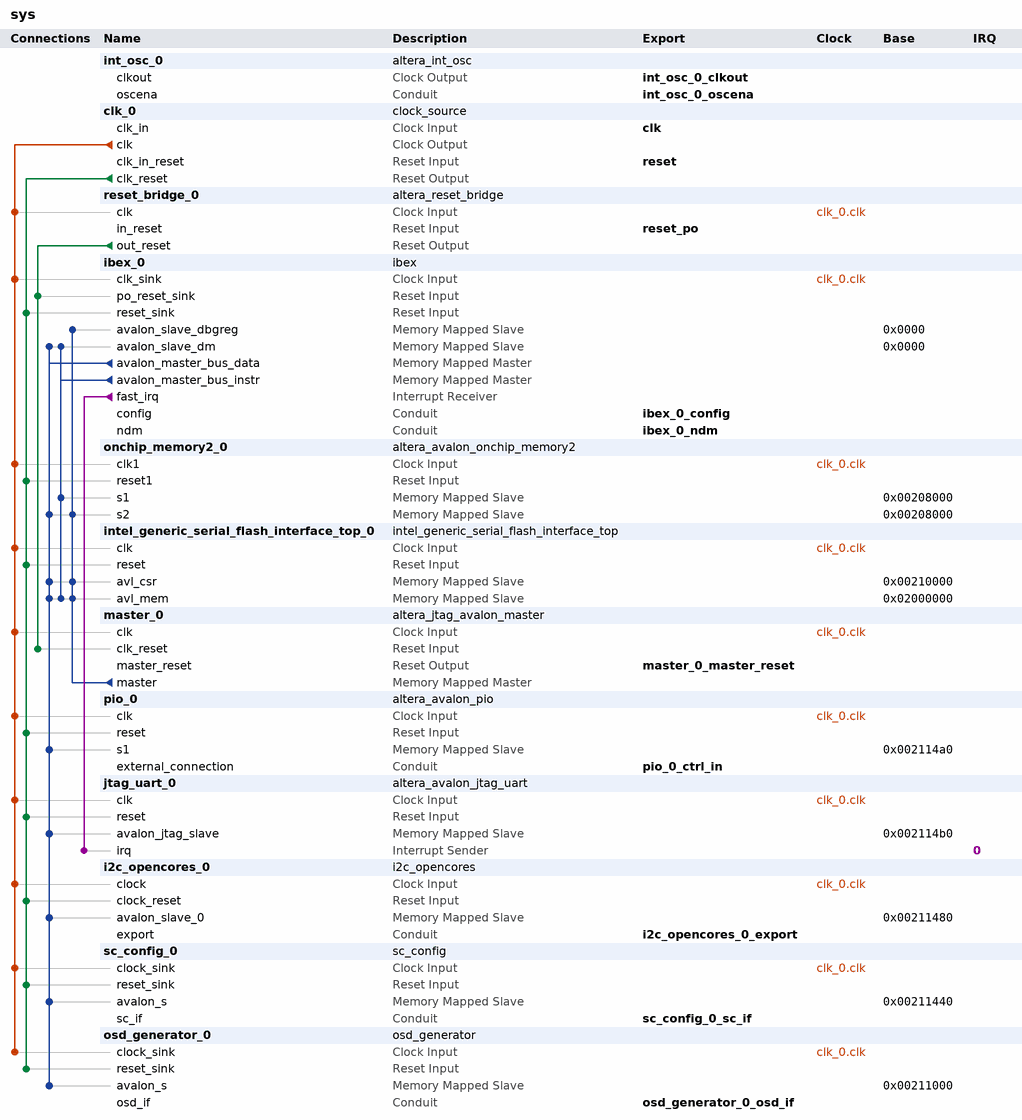
[diagram p0: system contents]
# Platform Designer (Qsys) system sys, Cyclone 10 LP 10CL025YE144C8G
# Parameters at their usual value, and those the tool derives, are not listed.
package require -exact qsys 24.1
create_system sys
set_project_property DEVICE_FAMILY {Cyclone 10 LP}
set_project_property DEVICE 10CL025YE144C8G

add_instance int_osc_0 altera_int_osc 24.1
set_instance_parameter_value int_osc_0 CBX_AUTO_BLACKBOX ALL
set_instance_parameter_value int_osc_0 CLOCK_FREQUENCY_1 116
set_instance_parameter_value int_osc_0 CLOCK_FREQUENCY_2 77
set_instance_parameter_value int_osc_0 PART_NAME 10CL025YE144C8G

add_instance clk_0 clock_source 24.1
set_instance_parameter_value clk_0 clockFrequency 40000000

add_instance reset_bridge_0 altera_reset_bridge 24.1
set_instance_parameter_value reset_bridge_0 ACTIVE_LOW_RESET 1
set_instance_parameter_value reset_bridge_0 SYNCHRONOUS_EDGES deassert

add_instance ibex_0 ibex 1.0
set_instance_parameter_value ibex_0 IBEX_ICACHE true
set_instance_parameter_value ibex_0 IBEX_RV32E true

add_instance onchip_memory2_0 altera_avalon_onchip_memory2 24.1
set_instance_parameter_value onchip_memory2_0 dataWidth 32
set_instance_parameter_value onchip_memory2_0 dualPort true
set_instance_parameter_value onchip_memory2_0 initMemContent false
set_instance_parameter_value onchip_memory2_0 initializationFileName onchip_mem.hex
set_instance_parameter_value onchip_memory2_0 memorySize 4096
set_instance_parameter_value onchip_memory2_0 resetrequest_enabled false
set_instance_parameter_value onchip_memory2_0 singleClockOperation true

add_instance intel_generic_serial_flash_interface_top_0 intel_generic_serial_flash_interface_top 24.1
set_instance_parameter_value intel_generic_serial_flash_interface_top_0 CHIP_SELECT_BYPASS false
set_instance_parameter_value intel_generic_serial_flash_interface_top_0 CHIP_SELS 1
set_instance_parameter_value intel_generic_serial_flash_interface_top_0 DEBUG_OPTION 0
set_instance_parameter_value intel_generic_serial_flash_interface_top_0 DEFAULT_VALUE_REG_0 1
set_instance_parameter_value intel_generic_serial_flash_interface_top_0 DEFAULT_VALUE_REG_1 1
set_instance_parameter_value intel_generic_serial_flash_interface_top_0 DEFAULT_VALUE_REG_2 0
set_instance_parameter_value intel_generic_serial_flash_interface_top_0 DEFAULT_VALUE_REG_3 0
set_instance_parameter_value intel_generic_serial_flash_interface_top_0 DEFAULT_VALUE_REG_4 0
set_instance_parameter_value intel_generic_serial_flash_interface_top_0 DEFAULT_VALUE_REG_5 3
set_instance_parameter_value intel_generic_serial_flash_interface_top_0 DEFAULT_VALUE_REG_6 1282
set_instance_parameter_value intel_generic_serial_flash_interface_top_0 DEFAULT_VALUE_REG_7 6149
set_instance_parameter_value intel_generic_serial_flash_interface_top_0 DEVICE_DENSITY 16
set_instance_parameter_value intel_generic_serial_flash_interface_top_0 ENABLE_SIM_MODEL false
set_instance_parameter_value intel_generic_serial_flash_interface_top_0 PIPE_CMD_GEN_CMD 0
set_instance_parameter_value intel_generic_serial_flash_interface_top_0 PIPE_CSR 0
set_instance_parameter_value intel_generic_serial_flash_interface_top_0 PIPE_MUX_CMD 0
set_instance_parameter_value intel_generic_serial_flash_interface_top_0 PIPE_XIP 0
set_instance_parameter_value intel_generic_serial_flash_interface_top_0 USE_CHIP_SEL_FROM_CSR 1
set_instance_parameter_value intel_generic_serial_flash_interface_top_0 gui_use_asmiblock false
set_instance_parameter_value intel_generic_serial_flash_interface_top_0 gui_use_csr_byteenable false
set_instance_parameter_value intel_generic_serial_flash_interface_top_0 gui_use_gpio false

add_instance master_0 altera_jtag_avalon_master 24.1

add_instance pio_0 altera_avalon_pio 24.1
set_instance_parameter_value pio_0 direction Input
set_instance_parameter_value pio_0 width 32

add_instance jtag_uart_0 altera_avalon_jtag_uart 24.1
set_instance_parameter_value jtag_uart_0 readBufferDepth 16
set_instance_parameter_value jtag_uart_0 simInteractiveOptions NO_INTERACTIVE_WINDOWS
set_instance_parameter_value jtag_uart_0 useRegistersForReadBuffer true
set_instance_parameter_value jtag_uart_0 useRegistersForWriteBuffer true
set_instance_parameter_value jtag_uart_0 writeBufferDepth 32

add_instance i2c_opencores_0 i2c_opencores 17.1
set_instance_parameter_value i2c_opencores_0 dedicated_spi 0

add_instance sc_config_0 sc_config 1.0

add_instance osd_generator_0 osd_generator 1.0

# connections
add_connection clk_0.clk i2c_opencores_0.clock clock
add_connection clk_0.clk ibex_0.clk_sink clock
add_connection clk_0.clk intel_generic_serial_flash_interface_top_0.clk clock
add_connection clk_0.clk jtag_uart_0.clk clock
add_connection clk_0.clk master_0.clk clock
add_connection clk_0.clk onchip_memory2_0.clk1 clock
add_connection clk_0.clk osd_generator_0.clock_sink clock
add_connection clk_0.clk pio_0.clk clock
add_connection clk_0.clk reset_bridge_0.clk clock
add_connection clk_0.clk sc_config_0.clock_sink clock
add_connection clk_0.clk_reset i2c_opencores_0.clock_reset reset
add_connection clk_0.clk_reset ibex_0.reset_sink reset
add_connection clk_0.clk_reset intel_generic_serial_flash_interface_top_0.reset reset
add_connection clk_0.clk_reset jtag_uart_0.reset reset
add_connection clk_0.clk_reset onchip_memory2_0.reset1 reset
add_connection clk_0.clk_reset osd_generator_0.reset_sink reset
add_connection clk_0.clk_reset pio_0.reset reset
add_connection clk_0.clk_reset sc_config_0.reset_sink reset
add_connection reset_bridge_0.out_reset ibex_0.po_reset_sink reset
add_connection reset_bridge_0.out_reset master_0.clk_reset reset
add_connection ibex_0.avalon_master_bus_data i2c_opencores_0.avalon_slave_0 avalon
set_connection_parameter_value ibex_0.avalon_master_bus_data/i2c_opencores_0.avalon_slave_0 baseAddress 0x00211480
add_connection ibex_0.avalon_master_bus_data ibex_0.avalon_slave_dm avalon
set_connection_parameter_value ibex_0.avalon_master_bus_data/ibex_0.avalon_slave_dm baseAddress 0x0000
add_connection ibex_0.avalon_master_bus_data intel_generic_serial_flash_interface_top_0.avl_csr avalon
set_connection_parameter_value ibex_0.avalon_master_bus_data/intel_generic_serial_flash_interface_top_0.avl_csr baseAddress 0x00210000
add_connection ibex_0.avalon_master_bus_data intel_generic_serial_flash_interface_top_0.avl_mem avalon
set_connection_parameter_value ibex_0.avalon_master_bus_data/intel_generic_serial_flash_interface_top_0.avl_mem baseAddress 0x02000000
add_connection ibex_0.avalon_master_bus_data jtag_uart_0.avalon_jtag_slave avalon
set_connection_parameter_value ibex_0.avalon_master_bus_data/jtag_uart_0.avalon_jtag_slave baseAddress 0x002114b0
add_connection ibex_0.avalon_master_bus_data onchip_memory2_0.s2 avalon
set_connection_parameter_value ibex_0.avalon_master_bus_data/onchip_memory2_0.s2 baseAddress 0x00208000
add_connection ibex_0.avalon_master_bus_data osd_generator_0.avalon_s avalon
set_connection_parameter_value ibex_0.avalon_master_bus_data/osd_generator_0.avalon_s baseAddress 0x00211000
add_connection ibex_0.avalon_master_bus_data pio_0.s1 avalon
set_connection_parameter_value ibex_0.avalon_master_bus_data/pio_0.s1 baseAddress 0x002114a0
add_connection ibex_0.avalon_master_bus_data sc_config_0.avalon_s avalon
set_connection_parameter_value ibex_0.avalon_master_bus_data/sc_config_0.avalon_s baseAddress 0x00211440
add_connection ibex_0.avalon_master_bus_instr ibex_0.avalon_slave_dm avalon
set_connection_parameter_value ibex_0.avalon_master_bus_instr/ibex_0.avalon_slave_dm baseAddress 0x0000
add_connection ibex_0.avalon_master_bus_instr intel_generic_serial_flash_interface_top_0.avl_mem avalon
set_connection_parameter_value ibex_0.avalon_master_bus_instr/intel_generic_serial_flash_interface_top_0.avl_mem baseAddress 0x02000000
add_connection ibex_0.avalon_master_bus_instr onchip_memory2_0.s1 avalon
set_connection_parameter_value ibex_0.avalon_master_bus_instr/onchip_memory2_0.s1 baseAddress 0x00208000
add_connection master_0.master ibex_0.avalon_slave_dbgreg avalon
set_connection_parameter_value master_0.master/ibex_0.avalon_slave_dbgreg baseAddress 0x0000
add_connection master_0.master intel_generic_serial_flash_interface_top_0.avl_csr avalon
set_connection_parameter_value master_0.master/intel_generic_serial_flash_interface_top_0.avl_csr baseAddress 0x00210000
add_connection master_0.master intel_generic_serial_flash_interface_top_0.avl_mem avalon
set_connection_parameter_value master_0.master/intel_generic_serial_flash_interface_top_0.avl_mem baseAddress 0x02000000
add_connection master_0.master onchip_memory2_0.s2 avalon
set_connection_parameter_value master_0.master/onchip_memory2_0.s2 baseAddress 0x00208000
add_connection ibex_0.fast_irq jtag_uart_0.irq interrupt
set_connection_parameter_value ibex_0.fast_irq/jtag_uart_0.irq irqNumber 0

# exported interfaces
add_interface clk clock sink
set_interface_property clk EXPORT_OF clk_0.clk_in
add_interface i2c_opencores_0_export conduit end
set_interface_property i2c_opencores_0_export EXPORT_OF i2c_opencores_0.export
add_interface ibex_0_config conduit end
set_interface_property ibex_0_config EXPORT_OF ibex_0.config
add_interface ibex_0_ndm conduit end
set_interface_property ibex_0_ndm EXPORT_OF ibex_0.ndm
add_interface int_osc_0_clkout clock source
set_interface_property int_osc_0_clkout EXPORT_OF int_osc_0.clkout
add_interface int_osc_0_oscena conduit end
set_interface_property int_osc_0_oscena EXPORT_OF int_osc_0.oscena
add_interface master_0_master_reset reset source
set_interface_property master_0_master_reset EXPORT_OF master_0.master_reset
add_interface osd_generator_0_osd_if conduit end
set_interface_property osd_generator_0_osd_if EXPORT_OF osd_generator_0.osd_if
add_interface pio_0_ctrl_in conduit end
set_interface_property pio_0_ctrl_in EXPORT_OF pio_0.external_connection
add_interface reset reset sink
set_interface_property reset EXPORT_OF clk_0.clk_in_reset
add_interface reset_po reset sink
set_interface_property reset_po EXPORT_OF reset_bridge_0.in_reset
add_interface sc_config_0_sc_if conduit end
set_interface_property sc_config_0_sc_if EXPORT_OF sc_config_0.sc_if

set_interconnect_requirement {$system} qsys_mm.clockCrossingAdapter HANDSHAKE
set_interconnect_requirement {$system} qsys_mm.enableEccProtection FALSE
set_interconnect_requirement {$system} qsys_mm.insertDefaultSlave FALSE
set_interconnect_requirement {$system} qsys_mm.maxAdditionalLatency 1

save_system sys.qsys
